# EAGLE design SOLARPANELCONN (EAGLE 9.6.2)
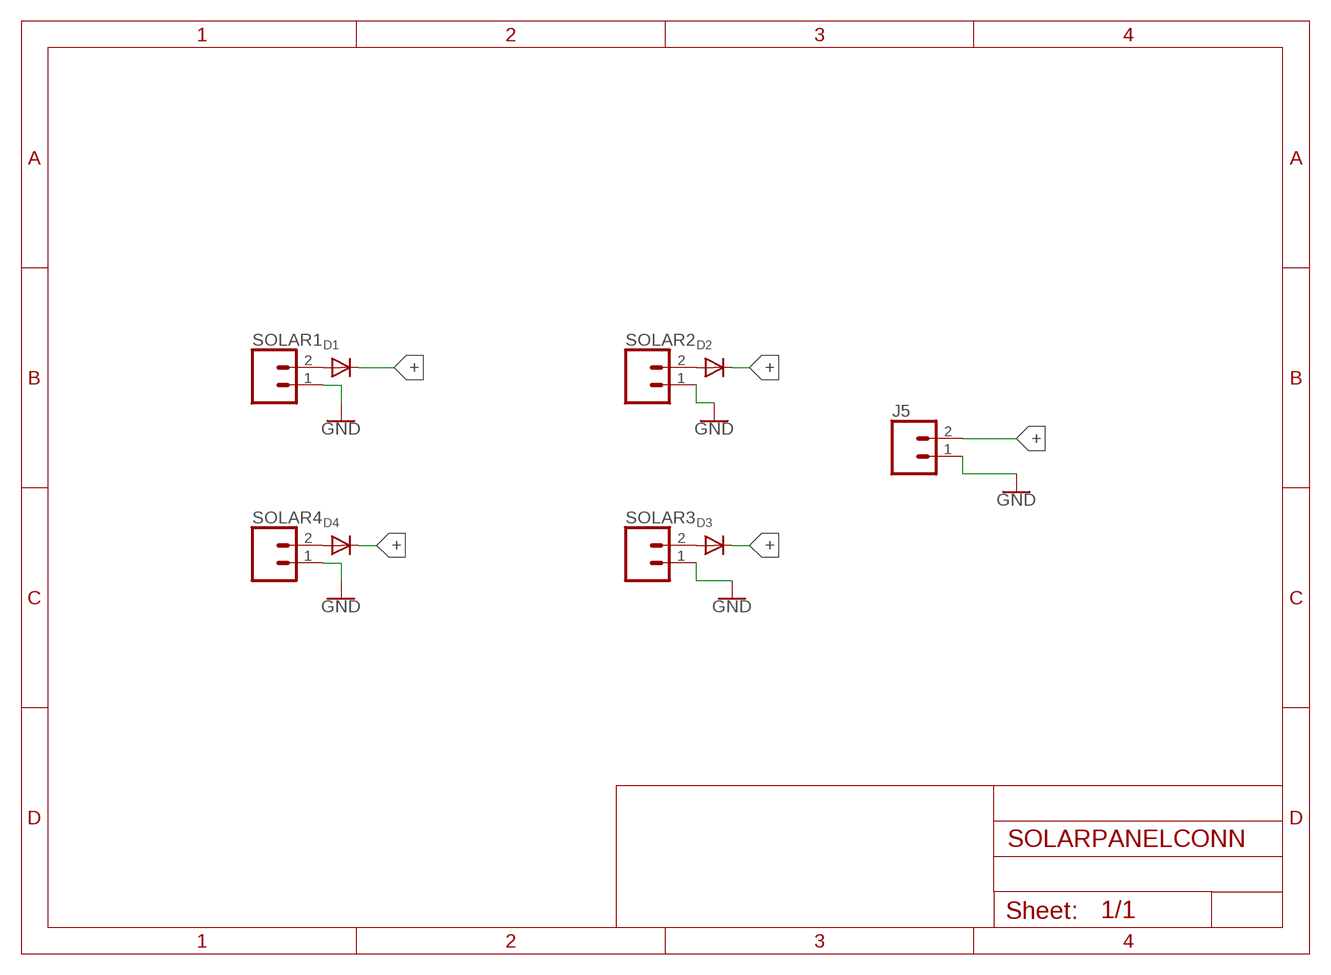
[diagram p0: schematic, sheet 1]

## Parts
D1  DIODESOD-123  [SOD-123]
D2  DIODESOD-123  [SOD-123]
D3  DIODESOD-123  [SOD-123]
D4  DIODESOD-123  [SOD-123]
J5  CONN_02  [1X02]
SOLAR1  CONN_02  [1X02]
SOLAR2  CONN_02  [1X02]
SOLAR3  CONN_02  [1X02]
SOLAR4  CONN_02  [1X02]

## Nets
+: D1.C D2.C D3.C D4.C J5.2
GND: J5.1 SOLAR1.1 SOLAR2.1 SOLAR3.1 SOLAR4.1
N$1: D1.A SOLAR1.2
N$2: D4.A SOLAR4.2
N$3: D3.A SOLAR3.2
N$4: D2.A SOLAR2.2

## Library data of the parts
D1-D4 = adafruit:DIODE: Diode SMADIODE - SMA Surface Mount Package 20V 1A Schottky Diode Digikey: 641-1014-6-ND DO-1N4148 - Through Hole Small Current Diode SOD-123 20V 1 A (.5mV Vf) Schottky Diode - Digikey: MBRX120TPMSCT-ND SOD-323 10V 570mA (.38mV Vf, 3ns) Schottky Diode - Digikey: ZLLS410CT-ND SOD-523 30V 30mA Schottky Diode (RB751S-40TE61) - Digikey: RB751S-40TE61CT-ND SOT23-R/W - SOT23 Package (R = Solder Paste/Reflow Ovens, W = Hand-Soldering) BAT54Film 40V 300mA - Digikey: 497-7162-1-ND
J5 SOLAR1-SOLAR4 = SparkFun-Connectors:CONN_02: Multi connection point. Often used as Generic Header-pin footprint for 0.1 inch spaced/style header connections On any of the 0.1 inch spaced packages, you can populate with these: Break Away Headers - Straight <https://www.sparkfun.com/products/116> (PRT-00116) Break Away Male Headers - Right Angle <https://www.sparkfun.com/products/553> (PRT-00553) Female Headers <https://www.sparkfun.com/products/115> (PRT-00115) Break Away Headers - Machine Pin <https://www.sparkfun.com/products/117> (PRT-00117) Break Away Female Headers - Swiss Machine Pin <https://www.sparkfun.com/products/743> (PRT-00743) For SCREWTERMINALS and SPRING TERMINALS visit here: Screw Terimnals on SparkFun.com <https://www.sparkfun.com/search/results?term=Screw+Terminals> (5mm/3.5mm/2.54mm spacing) This device is also useful as a general connection point to wire up your design to another part of your project. Our various solder wires solder well into these plated through hole pads. Hook-Up Wire - Assortment (Stranded, 22 AWG) <https://www.sparkfun.com/products/11375> (PRT-11375) Hook-Up Wire - Assortment (Solid Core, 22 AWG) <https://www.sparkfun.com/products/11367> (PRT-11367) View the entire wire category on our website here <https://www.sparkfun.com/categories/141> Special notes: Molex polarized connector foot print use with: PRT-08233 with associated crimp pins and housings. 2.54_SCREWTERM for use with PRT-10571. 3.5mm Screw Terminal footprints for PRT-08084 5mm Screw Terminal footprints for use with PRT-08432

## Board
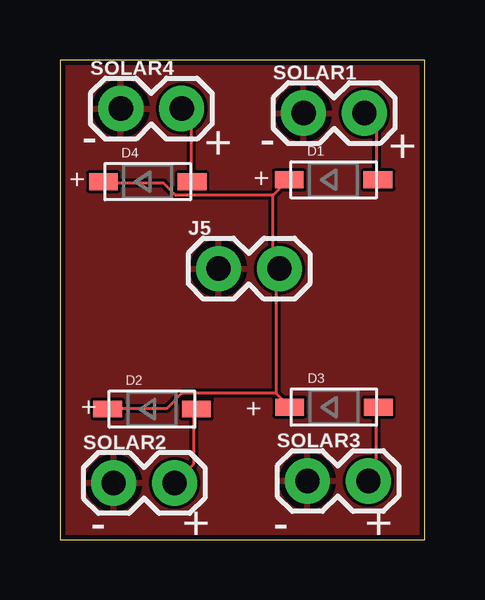
[diagram p1: board, top side]
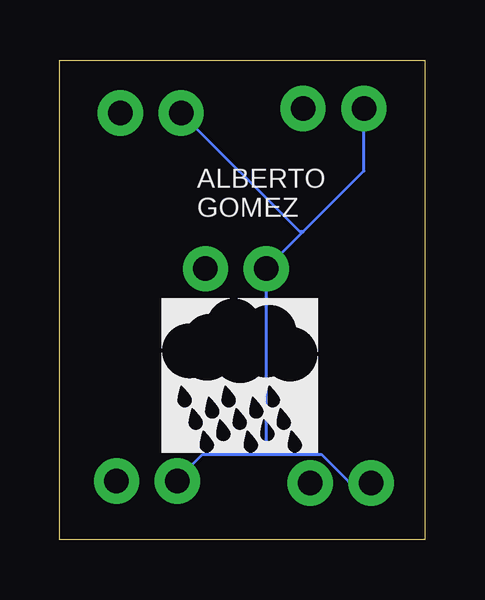
[diagram p2: board, bottom side, seen from below]

Size 15.22 x 19.99 mm. Coordinates in mm from the lower left corner, seen from the top.
Outline: 0,0 15.22,0 15.22,19.99 0,19.99 0,0
Copper layers (1*16): Top 0.035559375mm / dielectric 1.6mm / Bottom 0.035559375mm
Design rules "jlcpcb2layer": minimum track width 5mil, minimum drill 12mil, track to track 5mil, track to pad 5mil, pad to pad 5mil, via to via 5mil, smd to smd 5mil, copper to edge 8mil, drill to drill 6mil, minimum pad ring 5mil, minimum via ring 3mil, stop-mask expansion 2.5mil, vias tented up to drill 0mil, thermal gap 10mil

### Footprints (pad centres in the part's own frame; a part is rotated, then mirrored left to right if it is on the bottom)
SOD-123 = smd 1.2 x 0.7: A 1.85,0; C -1.85,0
1X02 = drill 1.016 pad 1.88: 1 0,0; 2 2.54,0

### Placement (x,y rotation side)
D1  11.41,15 0 top
D2  3.84,5.45 0 top
D3  11.43,5.53 0 top
D4  3.66,14.92 0 top
J5  6.61,11.3 0 top
SOLAR1  10.16,17.78 0 top
SOLAR2  2.24,2.37 0 top
SOLAR3  10.32,2.45 0 top
SOLAR4  2.54,17.97 0 top

### Tracks (layer width: path | path; a pad name or v marks a point on that pad's centre or on a via)
+
  Top 0.127: 8.89,14.35 4.83,14.35 4.32,14.86 1.91,14.86 D4.C | 8.89,14.35 9.53,14.99 D1.C | 9.02,6.1 5.08,6.1 4.45,5.46 2.03,5.46 D2.C | 9.02,6.1 9.53,5.59 D3.C | 9.02,6.1 9.02,11.05 9.14,11.18 J5.2 8.89,11.56 8.89,14.35
GND
  Bottom 0.127: 6.6,3.56 9.27,3.56 10.29,2.54 SOLAR3.1 | 6.6,3.56 4.32,3.56 3.17,2.41 2.29,2.41 SOLAR2.1 | 6.6,3.56 6.6,11.18 J5.1 5.08,12.83 | SOLAR4.1 2.54,15.37 5.08,12.83 | SOLAR1.1 5.21,12.83 5.08,12.83
  pour Top: 0,20 15.21,20 15.25,20.03 15.25,0.03 15.16,-0.06 0.16,-0.06 -0.06,0.16 -0.06,20 0,20.06
N$1
  Top 0.127: SOLAR1.2 13.21,17.27 13.21,15.11 D1.A
N$2
  Top 0.127: D4.A 5.46,14.99 5.46,17.53 5.08,17.91 SOLAR4.2
N$3
  Top 0.127: SOLAR3.2 13.21,2.79 13.21,5.46 D3.A
N$4
  Top 0.127: SOLAR2.2 5.59,3.17 5.59,5.33 D2.A

### Text on the board
tPlace: - | + | - | + | + | + | + | + | - | + | - | +
bPlace: ALBERTO / GOMEZ | ALBERTO / GOMEZ | ALBERTO / GOMEZ | ALBERTO / GOMEZ
tOrigins: D:/projectos/projecto estacion meteorologica/definitivo.bmp